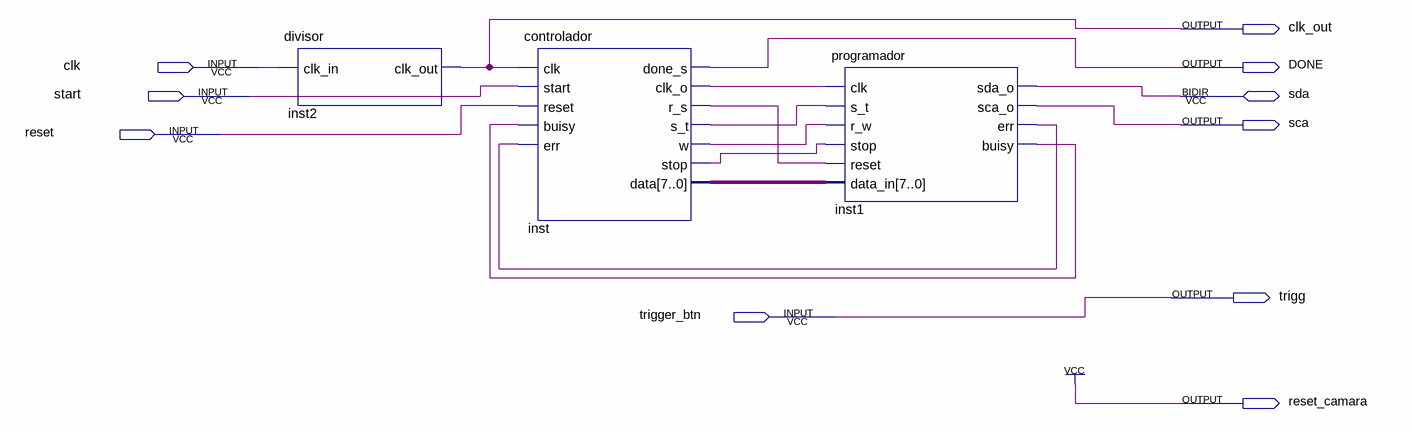
[diagram p0: schematic sheet]
// Quartus schematic Block1.bdf as structural Verilog: 3 symbols, 10 pins
module Block1 (
  input  clk,
  input  start,
  input  reset,
  input  trigger_btn,
  inout  sda,
  output clk_out,
  output DONE,
  output sca,
  output trigg,
  output reset_camara
);

  wire inst1_buisy, inst1_err, inst_clk_o, inst_r_s, inst_s_t, inst_stop, inst_w;
  wire [7:0] inst_data;

  divisor inst2 (.clk_in(clk), .clk_out(clk_out));
  controlador inst (
    .clk(clk_out), .start(start), .reset(reset), .buisy(inst1_buisy), .err(inst1_err), .done_s(DONE),
    .clk_o(inst_clk_o), .r_s(inst_r_s), .s_t(inst_s_t), .w(inst_w), .stop(inst_stop), .data(inst_data));
  programador inst1 (
    .clk(inst_clk_o), .s_t(inst_s_t), .r_w(inst_w), .stop(inst_stop), .reset(inst_r_s), .data_in(inst_data),
    .sca_o(sca), .err(inst1_err), .buisy(inst1_buisy), .sda_o(sda));

  assign reset_camara = 1'b1;
  assign trigg = trigger_btn;
endmodule
